# Altium schematic sheet USB-RIAA.SchDoc
size A3
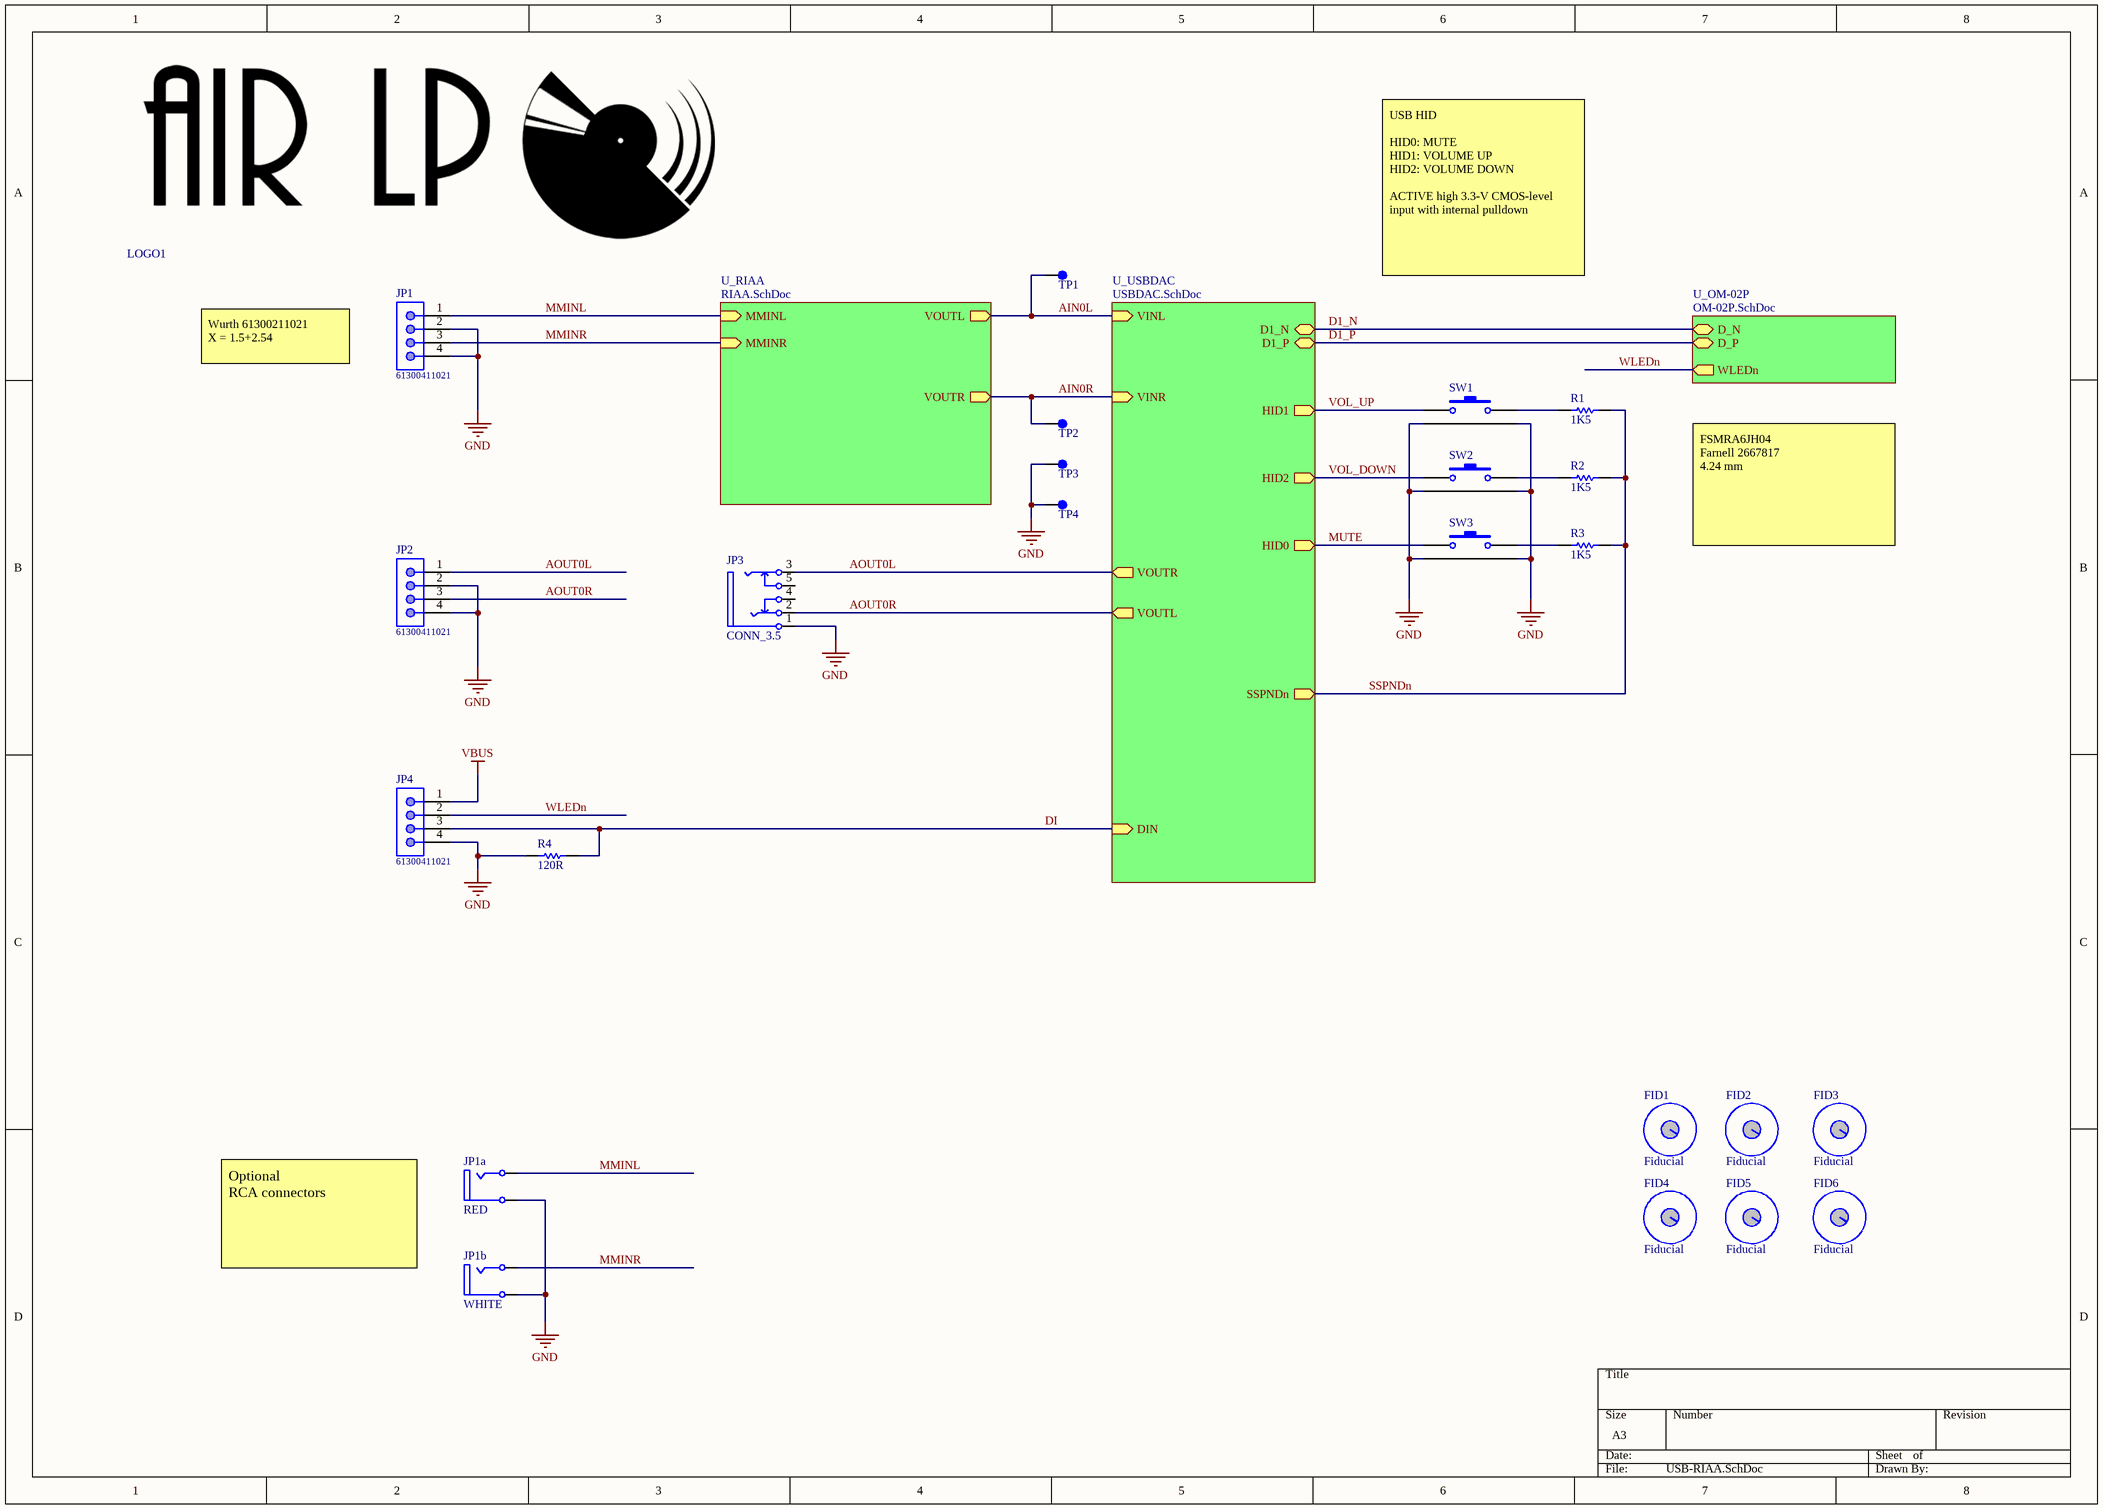
[diagram p0: USB-RIAA.SchDoc]

## Parts
FID1  Fiducial  [MECH_FID_PLUS]  (no BOM)
FID2  Fiducial  [MECH_FID_PLUS]  (no BOM)
FID3  Fiducial  [MECH_FID_PLUS]  (no BOM)
FID4  Fiducial  [MECH_FID_PLUS]  (no BOM)
FID5  Fiducial  [MECH_FID_PLUS]  (no BOM)
FID6  Fiducial  [MECH_FID_PLUS]  (no BOM)
JP1  61300411021  [61300411021]
JP1a  value RED  [CONN_RCA-Lumberg-Red-No3D]  (hidden comment: RCA RED)
JP1b  value WHITE  [CONN_RCA-Lumberg-White-No3D]  (hidden comment: RCA WHITE)
JP2  61300411021  [61300411021]
JP3  CONN_3.5  [CONN-3.5_LUMBERG_1503_09]
JP4  61300411021  [61300411021]
LOGO1  LOGO-AIRLP  [LOGO-AIR-LP]  (value not drawn)
R1  value 1K5  [RESC0805(2012)_N]  (hidden comment: RES)
R2  value 1K5  [RESC0805(2012)_N]  (hidden comment: RES)
R3  value 1K5  [RESC0805(2012)_N]  (hidden comment: RES)
R4  value 120R  [RESC0805(2012)_N]  (hidden comment: 120R 5% 0805(2012))
SW1  SW_TACT_FSMRA2JH  [SW_FSMRA2JH]  (value not drawn)
SW2  SW_TACT_FSMRA2JH  [SW_FSMRA2JH]  (value not drawn)
SW3  SW_TACT_FSMRA2JH  [SW_FSMRA2JH]  (value not drawn)
TP1  MECH_Testpoint  [MECH_TP_39_mil]  (value not drawn)
TP2  MECH_Testpoint  [MECH_TP_39_mil]  (value not drawn)
TP3  MECH_Testpoint  [MECH_TP_39_mil]  (value not drawn)
TP4  MECH_Testpoint  [MECH_TP_39_mil]  (value not drawn)

## Sub-sheets
U_OM-02P = OM-02P.SchDoc: D_P (bidir), D_N (bidir), WLEDn (out)
U_RIAA = RIAA.SchDoc: MMINL (in), MMINR (in), VOUTL (out), VOUTR (out)
U_USBDAC = USBDAC.SchDoc: VINL (in), VINR (in), VOUTL (out), VOUTR (out), SSPNDn (out), D1_P (bidir), D1_N (bidir), HID0 (out), HID1 (out), HID2 (out), DIN (in)

## Nets
GND: JP1.2 JP1.4 JP1a.1(Ground) JP1b.1(Ground) JP2.2 JP2.4 JP3.1(S) JP4.4 R4.1 SW1.3 SW1.4 SW2.3 SW2.4 SW3.3 SW3.4 TP3.1(Pin1) TP4.1(Pin1)
VBUS: JP4.1
AIN0L: TP1.1(Pin1) ; sheet U_RIAA/VOUTL, sheet U_USBDAC/VINL
AIN0R: TP2.1(Pin1) ; sheet U_RIAA/VOUTR, sheet U_USBDAC/VINR
AOUT0L: JP2.1 JP3.3(RN) ; sheet U_USBDAC/VOUTR
AOUT0R: JP2.3 JP3.2(T) ; sheet U_USBDAC/VOUTL
D1_N: sheet U_USBDAC/D1_N, sheet U_OM-02P/D_N
D1_P: sheet U_USBDAC/D1_P, sheet U_OM-02P/D_P
DI: JP4.3 R4.2 ; sheet U_USBDAC/DIN
MMINL: JP1.1 JP1a.4(Signal) ; sheet U_RIAA/MMINL
MMINR: JP1.3 JP1b.4(Signal) ; sheet U_RIAA/MMINR
MUTE: SW3.1 ; sheet U_USBDAC/HID0
SSPNDn: R1.1 R2.1 R3.1 ; sheet U_USBDAC/SSPNDn
VOL_DOWN: SW2.1 ; sheet U_USBDAC/HID2
VOL_UP: SW1.1 ; sheet U_USBDAC/HID1
WLEDn: JP4.2 ; sheet U_OM-02P/WLEDn
NetR1_2: R1.2 SW1.2
NetR2_2: R2.2 SW2.2
NetR3_2: R3.2 SW3.2

Not connected (* = marked no-connect by the designer): JP3 4 5

## Notes on the sheet
- USB HID
  HID0:	MUTE
  HID1:	VOLUME UP
  HID2:	VOLUME DOWN
  ACTIVE high 3.3-V CMOS-level input with internal pulldown
- Wurth 61300211021
  X = 1.5+2.54
- FSMRA6JH04
  Farnell 2667817
  4.24 mm
- Optional
  RCA connectors

## Library data of the parts
FID1-FID6 = MECH_FIDUCIAL_PLUS
JP1 JP2 JP4 = 61300411021: THT Angled Pin Header WR-PHD, Pitch 2.54 mm, Single Row, 4 pins; Pin Number: 4; Pitch: 2.54 mm; Gender: Male; Rated Current: 3 A; Working Voltage: 250 VAC; Withstanding Voltage: 500 VAC; Contact Resistance: 20 mOhm; ComponentLink1Description: Manufacturer; ComponentLink1URL: http://www.we-online.de; ComponentLink2Description: Datasheet; ComponentLink2URL: https://katalog.we-online.de/em/datasheet/6130xx11021.pdf; Part Number: 61300411021; Published Date: August 2018; Publisher: Wurth Elektronik; Operating Temperature: -40 to 105 degC; Mounting Technology: THT; Packaging: Bag; Row Number: Single; Orientation: Angled
JP1a = CONN_RCA_LUMBERG_RED: RCA panel-mount socket red, 1553 02 rot, Lumberg Connect GmbH; ELFA: 300-68-374; MPN: 1553 02 rot
JP1b = CONN_RCA_LUMBERG_WHITE: RCA panel-mount socket white, 1553 02 weiss, Lumberg Connect GmbH; ELFA: 300-68-376; MPN: 1553 02 weiss; Farnell: 2472276
JP3 = CONN_3.5_1503_09: Jack Socket, 3.5mm, Thru-Hole, Horizontal, 3-Conductor with Tip open & Ring closed; MPN: 1503 09; ELFA: 300-68-357; Farnell: 1243244
LOGO1 = LOGO-AIRLP: LOGO AIR LP
R1-R3 = RES: Generic resistor
R4 = CMP-1013-00052-1: 120R 0.125W 5% 0805 (2012 Metric)  SMD; Case-Metric: 2012; Case-EIA: 0805; Tolerance: 5 %; Technology: SMT; Power: 0.125 W
SW1-SW3 = SW_TACT_FSMRA2JH: SWITCH TACTILE SPST-NO 0.05A 12V; ELFA: 35-665-57; DigiKey: 450-1662-ND; Farnell: 1555987; MPN: FSMRA2JH
TP1-TP4 = MECH_Testpoint: Testpoint